# Altium project V_1.PrjPcb
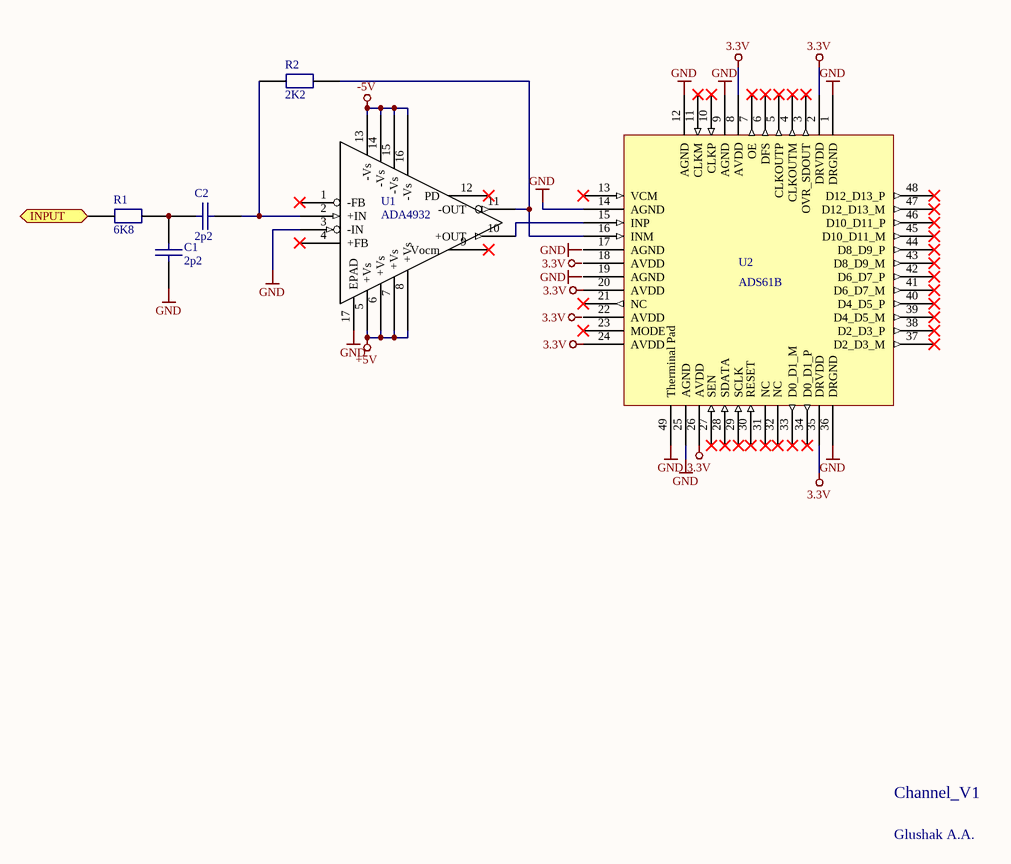
[diagram p0: V_1.SchDoc]
1 sheet, 6 parts. Net scope: flat (ports and power ports of the same name join across sheets).
Board file: V_1.PcbDoc

## Sheet V_1.SchDoc
size A4

### Parts
C1  2p2  [Cap0805]
C2  2p2  [Cap0805]
R1  6K8  [Res0805]
R2  2K2  [Res0805]
U1  ADA4932  [ADA4932]
U2  ADS61B  [ADS61B49]

### Ports
INPUT (in)

### Nets
3.3V: U2.2(DRVDD) U2.8(AVDD) U2.20(AVDD) U2.24(AVDD) U2.26(AVDD) U2.35(DRVDD)
+5V: U1.5(+Vs) U1.6(+Vs) U1.7(+Vs) U1.8(+Vs)
-5V: U1.13(-Vs) U1.14(-Vs) U1.15(-Vs) U1.16(-Vs)
GND: C1.1 U1.3(-IN) U1.17(EPAD) U2.1(DRGND) U2.9(AGND) U2.12(AGND) U2.14(AGND) U2.25(AGND) U2.36(DRGND) U2.49(Therminal_Pad)
NetC1_2: C1.2 C2.2 R1.2
NetC2_1: C2.1 R2.1 U1.2(+IN)
NetR1_1: R1.1 ; port INPUT
NetR2_2: R2.2 U1.11(-OUT) U2.16(INM)
NetU1_10: U1.10(+OUT) U2.15(INP)

Not connected (* = marked no-connect by the designer): U1 1(-FB)* 4(+FB)* 9(Vocm)* 12(PD)*; U2 3(OVR_SDOUT)* 4(CLKOUTM)* 5(CLKOUTP)* 6(DFS)* 7(OE)* 10(CLKP)* 11(CLKM)* 13(VCM)* 17(AGND) 18(AVDD) 19(AGND) 21(NC)* 22(AVDD) 23(MODE)* 27(SEN)* 28(SDATA)* 29(SCLK)* 30(RESET)* 31(NC)* 32(NC)* 33(D0_D1_M)* 34(D0_D1_P)* 37(D2_D3_M)* 38(D2_D3_P)* 39(D4_D5_M)* 40(D4_D5_P)* 41(D6_D7_M)* 42(D6_D7_P)* 43(D8_D9_M)* 44(D8_D9_P)* 45(D10_D11_M)* 46(D10_D11_P)* 47(D12_D13_M)* 48(D12_D13_P)*

### Notes on the sheet
- Channel_V1
- Glushak A.A.
- Labels drawn without touching a wire or pin: 3.3V, GND

### Library data of the parts
C1 C2 = Cap: Value: 2p2
R1 R2 = Res
  R1: Value: 6K8
  R2: Value: 2K2
U2 = ADS61B49: Value: ADS61B
U1 = ADA4932: Value: ADA4932